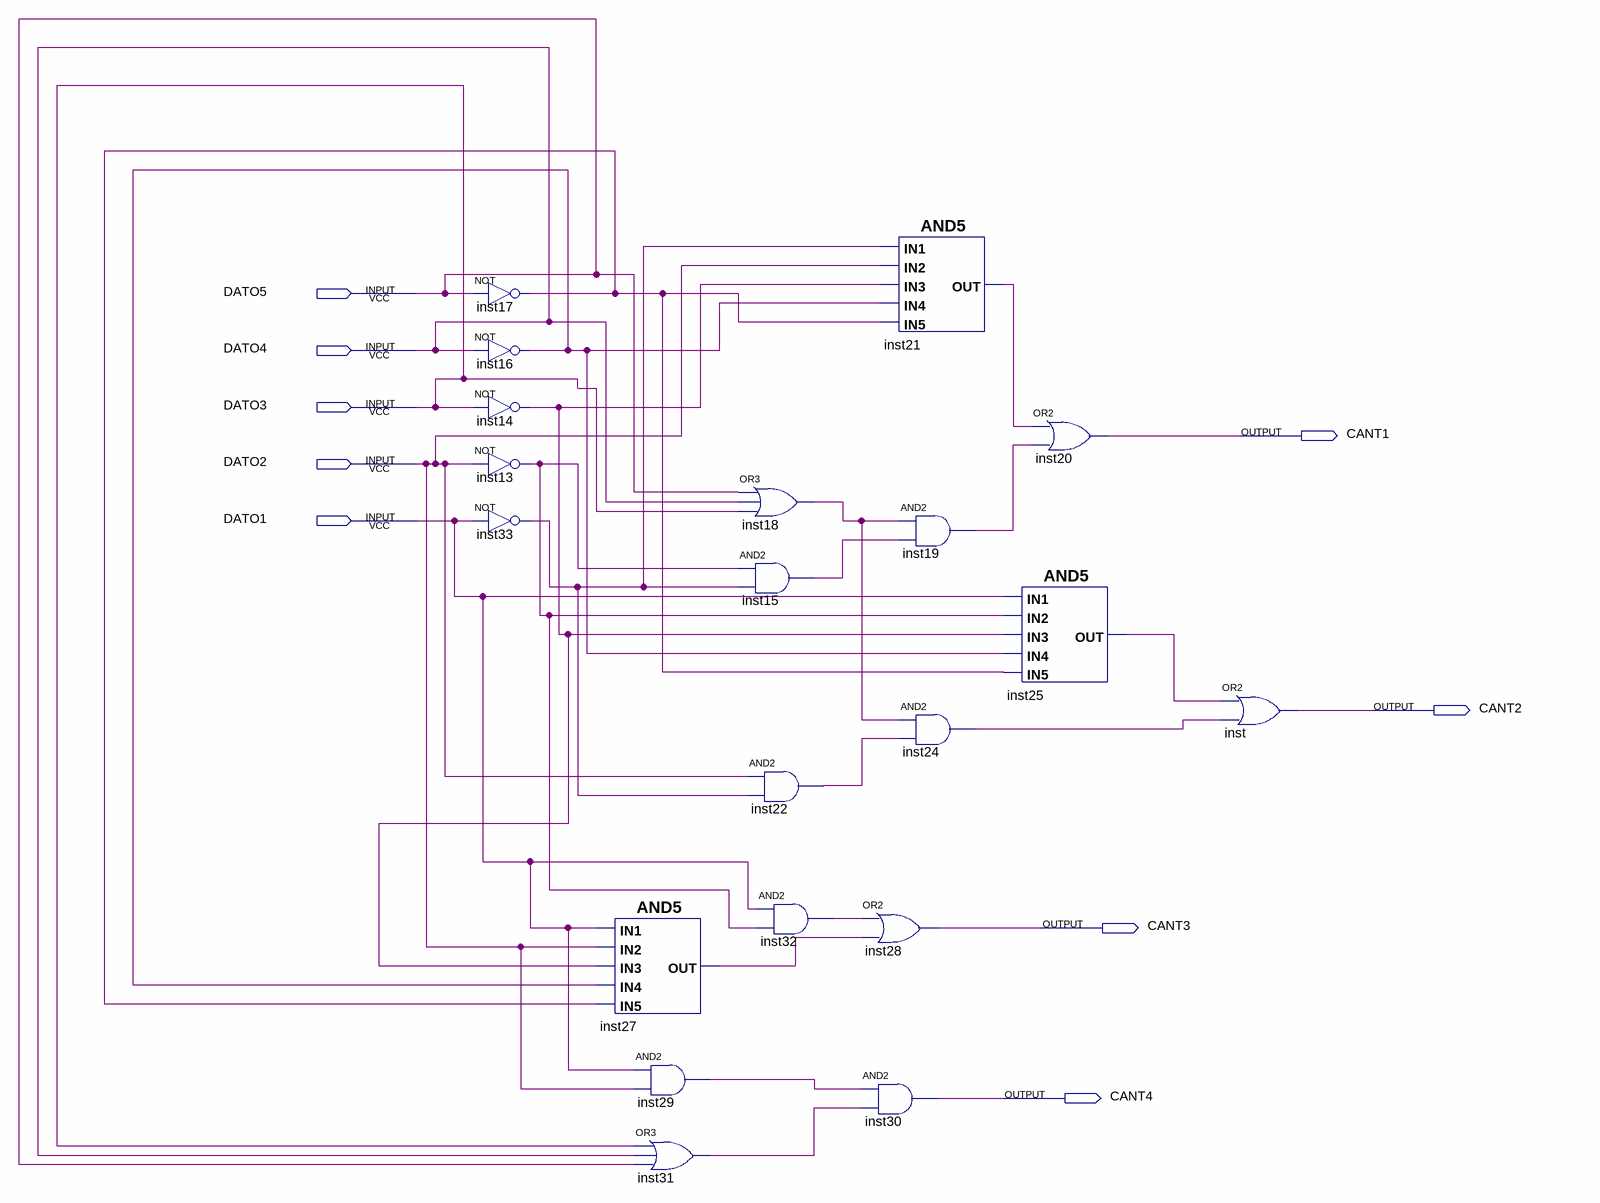
[diagram p0: schematic sheet]
// Quartus schematic Controlador_de_envio_de_datos_2.bdf as structural Verilog: 20 symbols, 9 pins
module Controlador_de_envio_de_datos_2 (
  input  DATO5,
  input  DATO4,
  input  DATO3,
  input  DATO2,
  input  DATO1,
  output CANT1,
  output CANT2,
  output CANT3,
  output CANT4
);

  wire inst13_out, inst14_out, inst15_out, inst16_out, inst17_out, inst18_out, inst19_out, inst21_out,
       inst22_out, inst24_out, inst25_out, inst27_out, inst29_out, inst31_out, inst32_out, inst33_out;

  not inst17 (inst17_out, DATO5);
  not inst16 (inst16_out, DATO4);
  not inst14 (inst14_out, DATO3);
  not inst13 (inst13_out, DATO2);
  not inst33 (inst33_out, DATO1);
  and inst27 (inst27_out, DATO1, DATO2, inst14_out, inst16_out, inst17_out);
  and inst29 (inst29_out, DATO1, DATO2);
  or inst31 (inst31_out, DATO3, DATO4, DATO5);
  or inst18 (inst18_out, DATO5, DATO4, DATO3);
  and inst15 (inst15_out, inst13_out, inst33_out);
  and inst22 (inst22_out, DATO2, inst33_out);
  and inst32 (inst32_out, DATO1, inst13_out);
  and inst21 (inst21_out, inst33_out, DATO2, inst14_out, inst16_out, inst17_out);
  or inst28 (CANT3, inst32_out, inst27_out);
  and inst30 (CANT4, inst29_out, inst31_out);
  and inst19 (inst19_out, inst18_out, inst15_out);
  and inst24 (inst24_out, inst18_out, inst22_out);
  or inst20 (CANT1, inst21_out, inst19_out);
  and inst25 (inst25_out, DATO1, inst13_out, inst14_out, inst16_out, inst17_out);
  or inst (CANT2, inst25_out, inst24_out);
endmodule
